# Altium schematic sheet RADG-Connector-S04-V00.SchDoc: RADG Connector (Logic Analyser Header, 60Pin 0.5mm FFC)
size A3; DrawnBy: Jonn Dillon; DocumentNumber: 4; SheetNumber: 4; SheetTotal: 5; Version: 00; Project: QUTMS RADIO GPS; PageSetup: Record=PageOptions|CenterHorizontal=True|CenterVertical=True|PrintScale=0.97|XCorrection=1.00|YCorrection=1.00|PrintKind=0|BorderSize=5000000|LeftOffset=0|BottomOffset=0|Orientation=2|PaperLength=1000|PaperWidth=1000|Scale=100|PaperSource=7|PrintQuality=-4|MediaType=1|DitherType=10|PaperKind=A4|PrintScaleMode=1
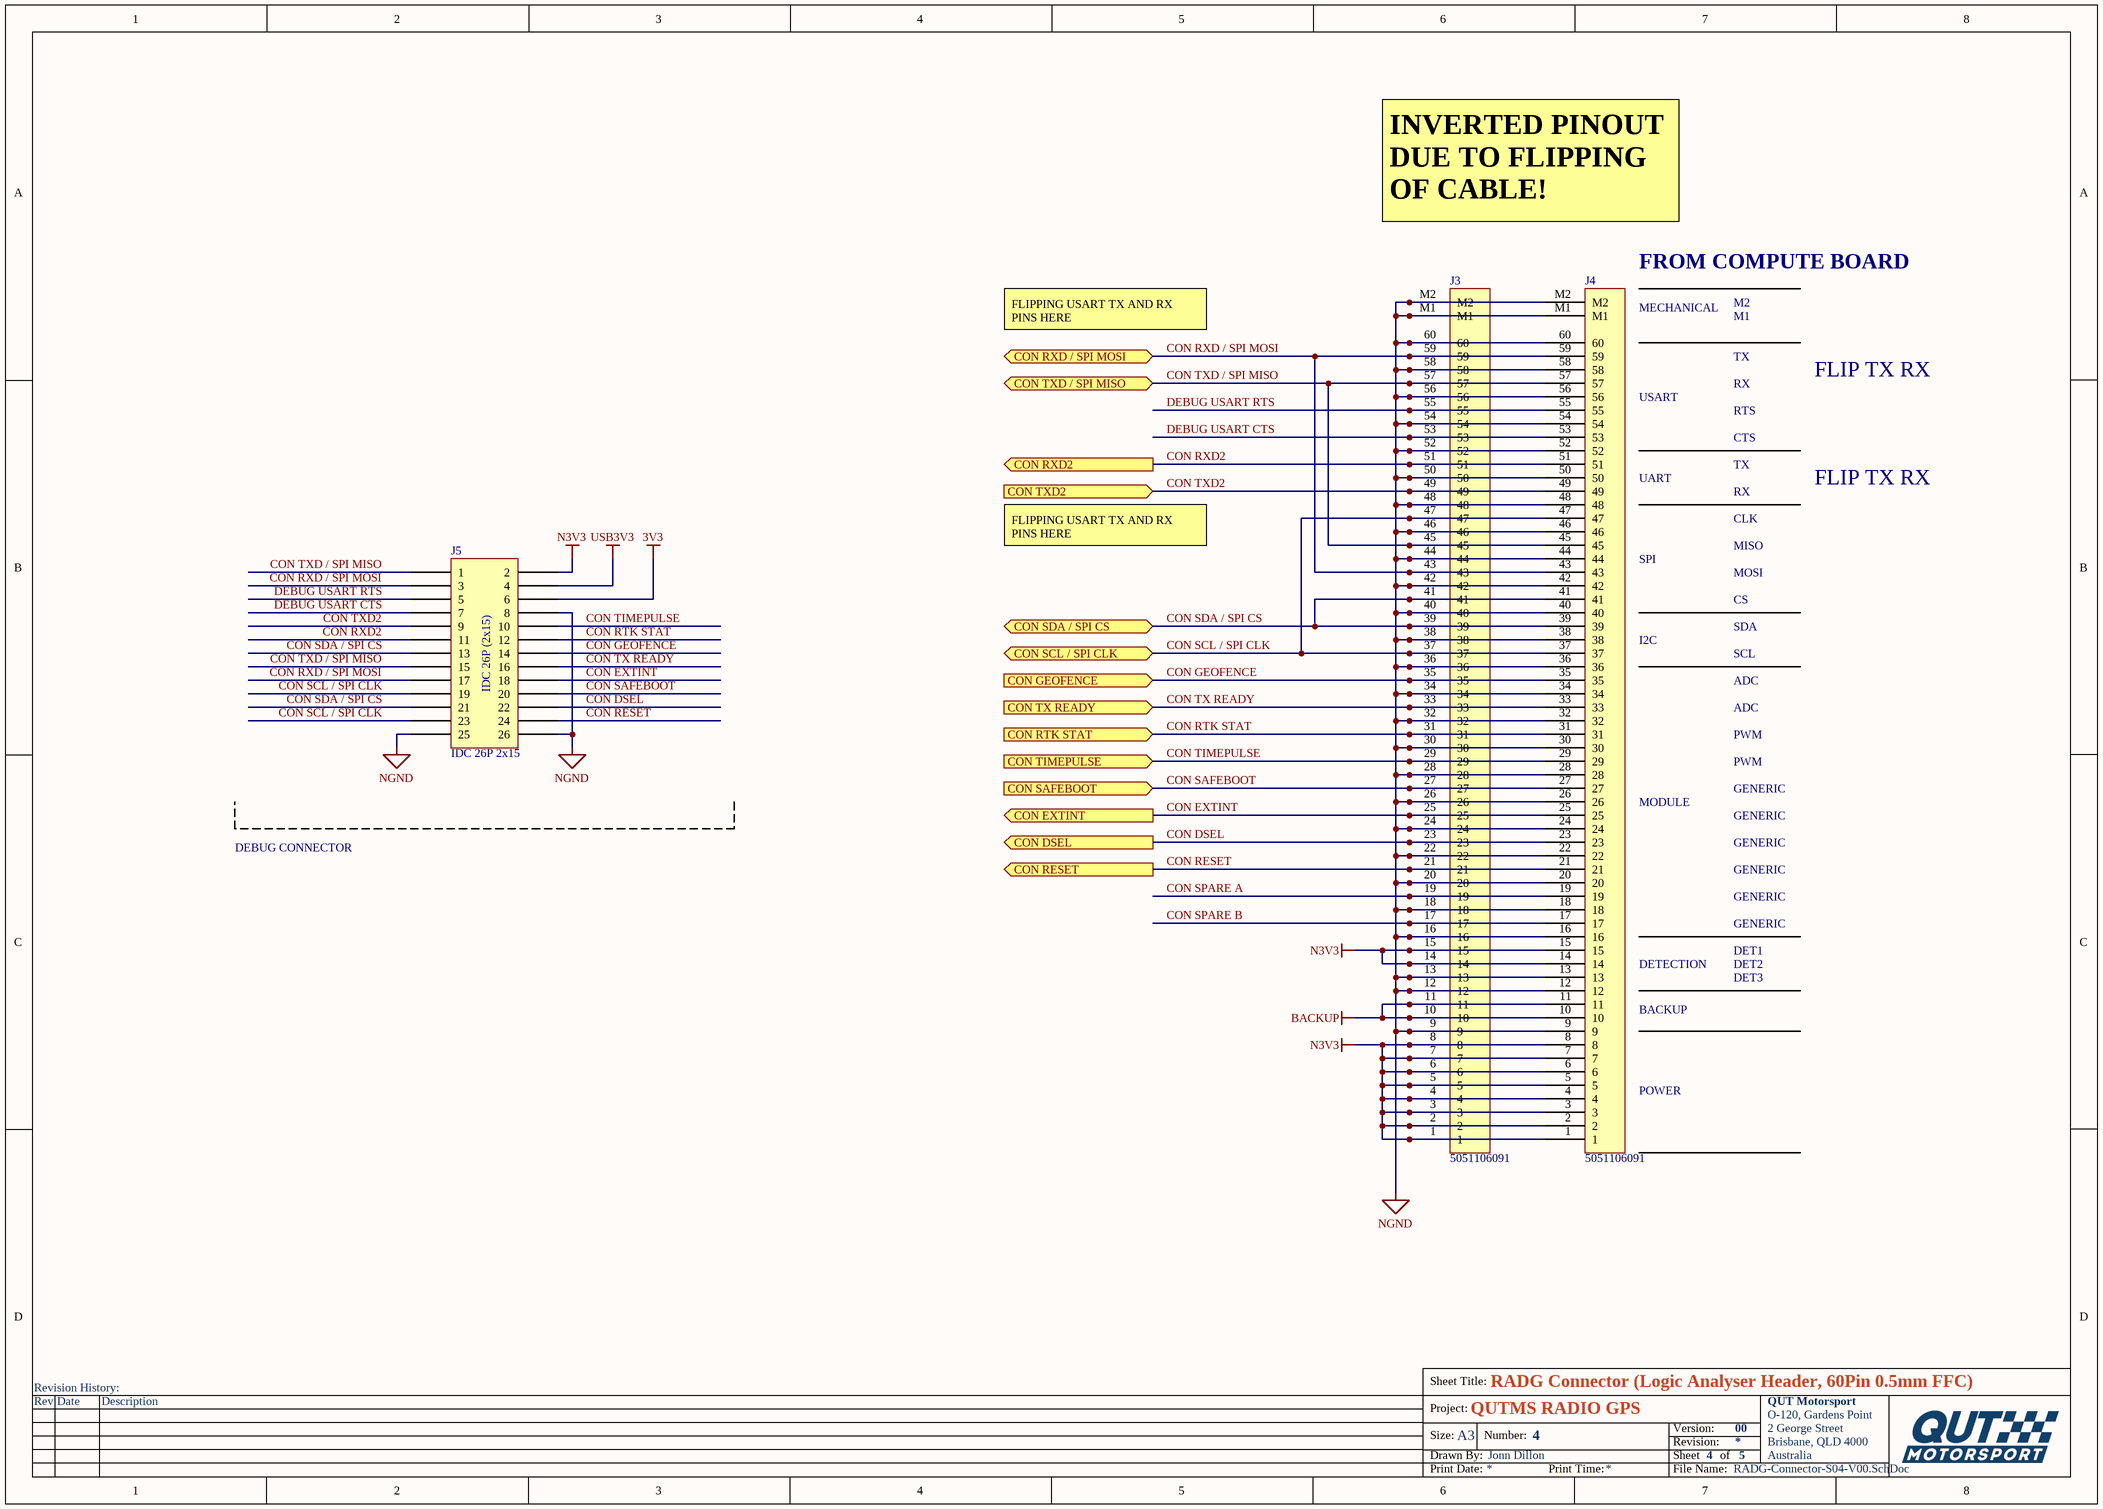
[diagram p0: RADG-Connector-S04-V00.SchDoc]

## Parts
J3  5051106091  [5051106091]
J4  5051106091  [5051106091]
J5  IDC 26P 2x15  [IDC 2.54mm EDGE MOUNT 26p]

## Ports
CON DSEL (out), CON EXTINT (out), CON GEOFENCE (in), CON RESET (out), CON RTK STAT (in), CON RXD2 (out), CON RXD / SPI MOSI (bidir), CON SAFEBOOT (in), CON SCL / SPI CLK (bidir), CON SDA / SPI CS (bidir), CON TIMEPULSE (in), CON TX READY (in), CON TXD2 (in), CON TXD / SPI MISO (bidir)

## Nets
3V3: J5.6
BACKUP: J3.10 J3.11 J4.10 J4.11
N3V3: J3.1 J3.2 J3.3 J3.4 J3.5 J3.6 J3.7 J3.8 J3.14 J3.15 J4.1 J4.2 J4.3 J4.4 J4.5 J4.6 J4.7 J4.8 J4.14 J4.15 J5.2
NGND: J3.9 J3.12 J3.13 J3.16 J3.18 J3.20 J3.22 J3.24 J3.26 J3.28 J3.30 J3.32 J3.34 J3.36 J3.38 J3.40 J3.42 J3.44 J3.46 J3.48 J3.50 J3.52 J3.54 J3.56 J3.58 J3.60 J3.M1 J3.M2 J4.9 J4.12 J4.13 J4.16 J4.18 J4.20 J4.22 J4.24 J4.26 J4.28 J4.30 J4.32 J4.34 J4.36 J4.38 J4.40 J4.42 J4.44 J4.46 J4.48 J4.50 J4.52 J4.54 J4.56 J4.58 J4.60 J4.M1 J4.M2 J5.8 J5.25 J5.26
USB3V3: J5.4
CON DSEL: J3.23 J4.23 J5.22 ; port CON DSEL
CON EXTINT: J3.25 J4.25 J5.18 ; port CON EXTINT
CON GEOFENCE: J3.35 J4.35 J5.14 ; port CON GEOFENCE
CON RESET: J3.21 J4.21 J5.24 ; port CON RESET
CON RTK STAT: J3.31 J4.31 J5.12 ; port CON RTK STAT
CON RXD2: J3.51 J4.51 J5.11 ; port CON RXD2
CON RXD / SPI MOSI: J3.43 J3.59 J4.43 J4.59 J5.3 J5.17 ; port CON RXD / SPI MOSI
CON SAFEBOOT: J3.27 J4.27 J5.20 ; port CON SAFEBOOT
CON SCL / SPI CLK: J3.37 J3.47 J4.37 J4.47 J5.19 J5.23 ; port CON SCL / SPI CLK
CON SDA / SPI CS: J3.39 J3.41 J4.39 J4.41 J5.13 J5.21 ; port CON SDA / SPI CS
CON SPARE A: J3.19 J4.19
CON SPARE B: J3.17 J4.17
CON TIMEPULSE: J3.29 J4.29 J5.10 ; port CON TIMEPULSE
CON TX READY: J3.33 J4.33 J5.16 ; port CON TX READY
CON TXD2: J3.49 J4.49 J5.9 ; port CON TXD2
CON TXD / SPI MISO: J3.45 J3.57 J4.45 J4.57 J5.1 J5.15 ; port CON TXD / SPI MISO
DEBUG USART CTS: J3.53 J4.53 J5.7
DEBUG USART RTS: J3.55 J4.55 J5.5

## Notes on the sheet
- INVERTED PINOUT DUE TO FLIPPING OF CABLE!
- MECHANICAL
- FROM COMPUTE BOARD
- M2
- M1
- FLIPPING USART TX AND RX PINS HERE
- TX
- RX
- FLIP TX RX
- USART
- RTS
- CTS
- UART
- CLK
- SPI
- MISO
- MOSI
- I2C
- SDA
- SCL
- CS
- ADC
- PWM
- GENERIC
- DEBUG CONNECTOR
- MODULE
- DETECTION
- DET1
- DET2
- DET3
- BACKUP
- POWER
- Revision History:
- Sheet Title:
- Rev
- Date
- Description
- Project:
- Size:
- Drawn By:
- A3
- Number:
- Revision:
- Sheet
- Version:
- of
- QUT Motorsport
- O-120, Gardens Point
- 2 George Street
- Brisbane, QLD 4000
- Australia
- Print Date:
- Print Time:
- File Name:
- (in symbol IDC 26P 2x13) IDC 26P (2x15)

## Library data of the parts
J3 J4 = 5051106091: 60 Position FFC, FPC Connector Contacts, Bottom 0.020" (0.50mm) Surface Mount, Right Angle
J5 = IDC 26P 2x13